# Altium project Daughter_Board_IFRX_L.PrjPcb (part 2 of 2)

## Sheet CPLD.SchDoc: {Наименование}
size 420 x 297 mm; DocumentNumber: НРДЦ.ХХХХХХ.ХХХ ХХ; SheetNumber: {}; SheetTotal: {}; PageSetup: Record=PageOptions|CenterHorizontal=False|CenterVertical=False|PrintScale=0.95|XCorrection=0.00|YCorrection=0.00|PrintKind=1|BorderSize=5000000|LeftOffset=0|BottomOffset=0|Orientation=1|PaperLength=1000|PaperWidth=1000|Scale=100|PaperSource=15|PrintQuality=600|MediaType=1|DitherType=10|PaperKind=A4|PrintScaleMode=1; Rule: PcbType=ProtelPcb
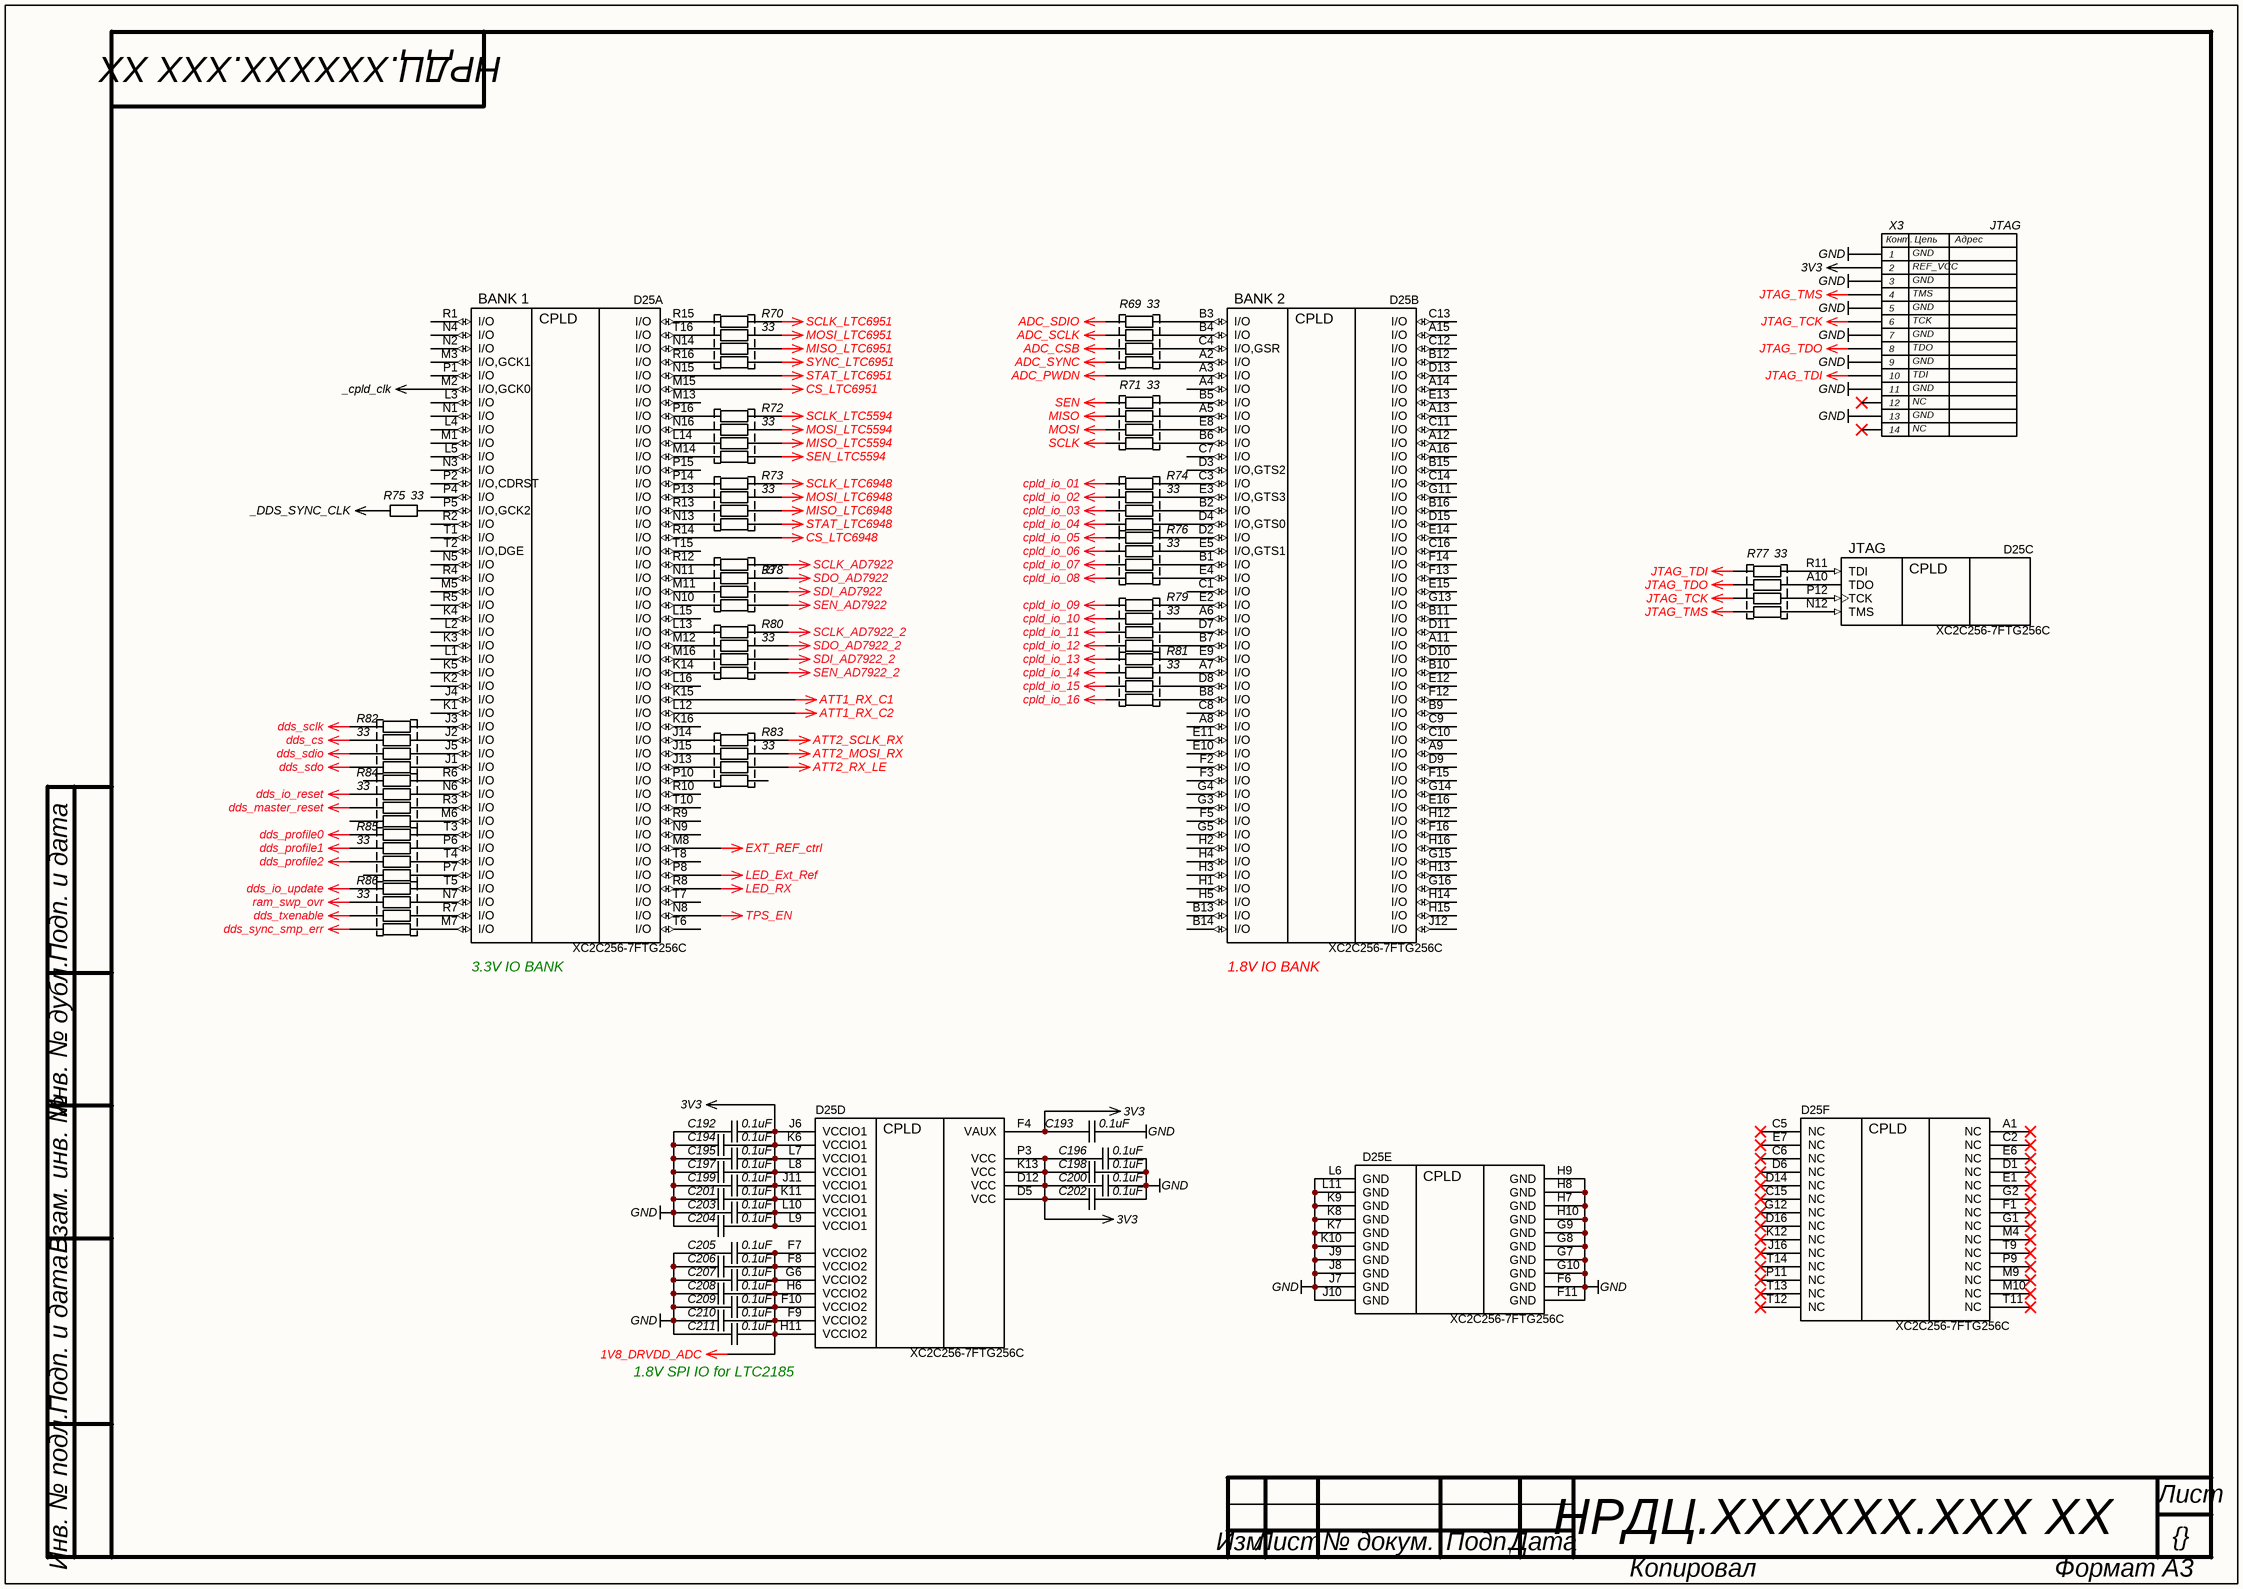
[diagram p4: CPLD.SchDoc]

### Parts
C192  value 0.1uF  [C0402]  (hidden comment: CAP)
C193  value 0.1uF  [C0402]  (hidden comment: CAP)
C194  value 0.1uF  [C0402]  (hidden comment: CAP)
C195  value 0.1uF  [C0402]  (hidden comment: CAP)
C196  value 0.1uF  [C0402]  (hidden comment: CAP)
C197  value 0.1uF  [C0402]  (hidden comment: CAP)
C198  value 0.1uF  [C0402]  (hidden comment: CAP)
C199  value 0.1uF  [C0402]  (hidden comment: CAP)
C200  value 0.1uF  [C0402]  (hidden comment: CAP)
C201  value 0.1uF  [C0402]  (hidden comment: CAP)
C202  value 0.1uF  [C0402]  (hidden comment: CAP)
C203  value 0.1uF  [C0402]  (hidden comment: CAP)
C204  value 0.1uF  [C0402]  (hidden comment: CAP)
C205  value 0.1uF  [C0402]  (hidden comment: CAP)
C206  value 0.1uF  [C0402]  (hidden comment: CAP)
C207  value 0.1uF  [C0402]  (hidden comment: CAP)
C208  value 0.1uF  [C0402]  (hidden comment: CAP)
C209  value 0.1uF  [C0402]  (hidden comment: CAP)
C210  value 0.1uF  [C0402]  (hidden comment: CAP)
C211  value 0.1uF  [C0402]  (hidden comment: CAP)
D25  XC2C256-7FTG256C  [FTG256]  (parts A,B,C,D,E,F of 6)
R69  value 33  [EXN8V]  (hidden comment: RES 4x0402)
R70  value 33  [EXN8V]  (hidden comment: RES 4x0402)
R71  value 33  [EXN8V]  (hidden comment: RES 4x0402)
R72  value 33  [EXN8V]  (hidden comment: RES 4x0402)
R73  value 33  [EXN8V]  (hidden comment: RES 4x0402)
R74  value 33  [EXN8V]  (hidden comment: RES 4x0402)
R75  value 33  [R0402]  (hidden comment: RES)
R76  value 33  [EXN8V]  (hidden comment: RES 4x0402)
R77  value 33  [EXN8V]  (hidden comment: RES 4x0402)
R78  value 33  [EXN8V]  (hidden comment: RES 4x0402)
R79  value 33  [EXN8V]  (hidden comment: RES 4x0402)
R80  value 33  [EXN8V]  (hidden comment: RES 4x0402)
R81  value 33  [EXN8V]  (hidden comment: RES 4x0402)
R82  value 33  [EXN8V]  (hidden comment: RES 4x0402)
R83  value 33  [EXN8V]  (hidden comment: RES 4x0402)
R84  value 33  [EXN8V]  (hidden comment: RES 4x0402)
R85  value 33  [EXN8V]  (hidden comment: RES 4x0402)
R86  value 33  [EXN8V]  (hidden comment: RES 4x0402)
X3  JTAG  [JTAG Mail 2mm]

### Nets
1V8_DRVDD_ADC: C205.2 C206.2 C207.2 C208.2 C209.2 C210.2 C211.2 D25.F7(VCCIO2) D25.F8(VCCIO2) D25.F9(VCCIO2) D25.F10(VCCIO2) D25.G6(VCCIO2) D25.H6(VCCIO2) D25.H11(VCCIO2)
3V3: C192.2 C193.1 C194.2 C195.2 C196.1 C197.2 C198.1 C199.2 C200.1 C201.2 C202.1 C203.2 C204.2 D25.D5(VCC) D25.D12(VCC) D25.F4(VAUX) D25.J6(VCCIO1) D25.J11(VCCIO1) D25.K6(VCCIO1) D25.K11(VCCIO1) D25.K13(VCC) D25.L7(VCCIO1) D25.L8(VCCIO1) D25.L9(VCCIO1) D25.L10(VCCIO1) D25.P3(VCC) X3.2
_cpld_clk: D25.M2(I/O,GCK0)
_DDS_SYNC_CLK: R75.1
ADC_CSB: R69.7
ADC_PWDN: D25.A3(I/O)
ADC_SCLK: R69.6
ADC_SDIO: R69.5
ADC_SYNC: R69.8
ATT1_RX_C1: D25.K15(I/O)
ATT1_RX_C2: D25.L12(I/O)
ATT2_MOSI_RX: R83.3
ATT2_RX_LE: R83.2
ATT2_SCLK_RX: R83.4
cpld_io_01: R74.5
cpld_io_02: R74.6
cpld_io_03: R74.7
cpld_io_04: R74.8
cpld_io_05: R76.5
cpld_io_06: R76.6
cpld_io_07: R76.7
cpld_io_08: R76.8
cpld_io_09: R79.5
cpld_io_10: R79.6
cpld_io_11: R79.7
cpld_io_12: R79.8
cpld_io_13: R81.5
cpld_io_14: R81.6
cpld_io_15: R81.7
cpld_io_16: R81.8
CS_LTC6948: D25.R14(I/O)
CS_LTC6951: D25.M15(I/O)
dds_cs: R82.6
dds_io_reset: R84.6
dds_io_update: R86.5
dds_master_reset: R84.7
dds_profile0: R85.5
dds_profile1: R85.6
dds_profile2: R85.7
dds_sclk: R82.5
dds_sdio: R82.7
dds_sdo: R82.8
dds_sync_smp_err: R86.8
dds_txenable: R86.7
EXT_REF_ctrl: D25.M8(I/O)
GND: C192.1 C193.2 C194.1 C195.1 C196.2 C197.1 C198.2 C199.1 C200.2 C201.1 C202.2 C203.1 C204.1 C205.1 C206.1 C207.1 C208.1 C209.1 C210.1 C211.1 D25.F6(GND) D25.F11(GND) D25.G7(GND) D25.G8(GND) D25.G9(GND) D25.G10(GND) D25.H7(GND) D25.H8(GND) D25.H9(GND) D25.H10(GND) D25.J7(GND) D25.J8(GND) D25.J9(GND) D25.J10(GND) D25.K7(GND) D25.K8(GND) D25.K9(GND) D25.K10(GND) D25.L6(GND) D25.L11(GND) X3.1 X3.3 X3.5 X3.7 X3.9 X3.11 X3.13
JTAG_TCK: R77.7 X3.6
JTAG_TDI: R77.5 X3.10
JTAG_TDO: R77.6 X3.8
JTAG_TMS: R77.8 X3.4
LED_Ext_Ref: D25.P8(I/O)
LED_RX: D25.R8(I/O)
MISO: R71.6
MISO_LTC5594: R72.2
MISO_LTC6948: R73.2
MISO_LTC6951: R70.2
MOSI: R71.7
MOSI_LTC5594: R72.3
MOSI_LTC6948: R73.3
MOSI_LTC6951: R70.3
ram_swp_ovr: R86.6
SCLK: R71.8
SCLK_AD7922: R78.4
SCLK_AD7922_2: R80.4
SCLK_LTC5594: R72.4
SCLK_LTC6948: R73.4
SCLK_LTC6951: R70.4
SDI_AD7922: R78.2
SDI_AD7922_2: R80.2
SDO_AD7922: R78.3
SDO_AD7922_2: R80.3
SEN: R71.5
SEN_AD7922: R78.1
SEN_AD7922_2: R80.1
SEN_LTC5594: R72.1
STAT_LTC6948: R73.1
STAT_LTC6951: D25.N15(I/O)
SYNC_LTC6951: R70.1
TPS_EN: D25.N8(I/O)
NetD25_A2: D25.A2(I/O) R69.1
NetD25_A5: D25.A5(I/O) R71.3
NetD25_A6: D25.A6(I/O) R79.3
NetD25_A7: D25.A7(I/O) R81.3
NetD25_A10: D25.A10(TDO) R77.3
NetD25_B1: D25.B1(I/O) R76.2
NetD25_B2: D25.B2(I/O) R74.2
NetD25_B3: D25.B3(I/O) R69.4
NetD25_B4: D25.B4(I/O) R69.3
NetD25_B5: D25.B5(I/O) R71.4
NetD25_B6: D25.B6(I/O) R71.1
NetD25_B7: D25.B7(I/O) R79.1
NetD25_B8: D25.B8(I/O) R81.1
NetD25_C3: D25.C3(I/O) R74.4
NetD25_C4: D25.C4(I/O,GSR) R69.2
NetD25_D2: D25.D2(I/O) R76.4
NetD25_D4: D25.D4(I/O,GTS0) R74.1
NetD25_D7: D25.D7(I/O) R79.2
NetD25_D8: D25.D8(I/O) R81.2
NetD25_E2: D25.E2(I/O) R79.4
NetD25_E3: D25.E3(I/O,GTS3) R74.3
NetD25_E4: D25.E4(I/O) R76.1
NetD25_E5: D25.E5(I/O,GTS1) R76.3
NetD25_E8: D25.E8(I/O) R71.2
NetD25_E9: D25.E9(I/O) R81.4
NetD25_J1: D25.J1(I/O) R82.1
NetD25_J2: D25.J2(I/O) R82.3
NetD25_J3: D25.J3(I/O) R82.4
NetD25_J5: D25.J5(I/O) R82.2
NetD25_J13: D25.J13(I/O) R83.7
NetD25_J14: D25.J14(I/O) R83.5
NetD25_J15: D25.J15(I/O) R83.6
NetD25_K14: D25.K14(I/O) R80.8
NetD25_L13: D25.L13(I/O) R80.5
NetD25_L14: D25.L14(I/O) R72.7
NetD25_M6: D25.M6(I/O) R84.1
NetD25_M7: D25.M7(I/O) R86.1
NetD25_M11: D25.M11(I/O) R78.7
NetD25_M12: D25.M12(I/O) R80.6
NetD25_M14: D25.M14(I/O) R72.8
NetD25_M16: D25.M16(I/O) R80.7
NetD25_N6: D25.N6(I/O) R84.3
NetD25_N7: D25.N7(I/O) R86.3
NetD25_N10: D25.N10(I/O) R78.8
NetD25_N11: D25.N11(I/O) R78.6
NetD25_N12: D25.N12(TMS) R77.1
NetD25_N13: D25.N13(I/O) R73.8
NetD25_N14: D25.N14(I/O) R70.7
NetD25_N16: D25.N16(I/O) R72.6
NetD25_P5: D25.P5(I/O,GCK2) R75.2
NetD25_P6: D25.P6(I/O) R85.3
NetD25_P7: D25.P7(I/O) R85.1
NetD25_P10: D25.P10(I/O) R83.8
NetD25_P12: D25.P12(TCK) R77.2
NetD25_P13: D25.P13(I/O) R73.6
NetD25_P14: D25.P14(I/O) R73.5
NetD25_P16: D25.P16(I/O) R72.5
NetD25_R3: D25.R3(I/O) R84.2
NetD25_R6: D25.R6(I/O) R84.4
NetD25_R7: D25.R7(I/O) R86.2
NetD25_R11: D25.R11(TDI) R77.4
NetD25_R12: D25.R12(I/O) R78.5
NetD25_R13: D25.R13(I/O) R73.7
NetD25_R15: D25.R15(I/O) R70.5
NetD25_R16: D25.R16(I/O) R70.8
NetD25_T3: D25.T3(I/O) R85.4
NetD25_T4: D25.T4(I/O) R85.2
NetD25_T5: D25.T5(I/O) R86.4
NetD25_T16: D25.T16(I/O) R70.6

Not connected (* = marked no-connect by the designer): D25 A1(NC)* A4(I/O) A8(I/O) A9(I/O) A11(I/O) A12(I/O) A13(I/O) A14(I/O) A15(I/O) A16(I/O) B9(I/O) B10(I/O) B11(I/O) B12(I/O) B13(I/O) B14(I/O) B15(I/O) B16(I/O) C1(I/O) C2(NC)* C5(NC)* C6(NC)* C7(I/O) C8(I/O) C9(I/O) C10(I/O) C11(I/O) C12(I/O) C13(I/O) C14(I/O) C15(NC)* C16(I/O) D1(NC)* D3(I/O,GTS2) D6(NC)* D9(I/O) D10(I/O) D11(I/O) D13(I/O) D14(NC)* D15(I/O) D16(NC)* E1(NC)* E6(NC)* E7(NC)* E10(I/O) E11(I/O) E12(I/O) E13(I/O) E14(I/O) E15(I/O) E16(I/O) F1(NC)* F2(I/O) F3(I/O) F5(I/O) F12(I/O) F13(I/O) F14(I/O) F15(I/O) F16(I/O) G1(NC)* G2(NC)* G3(I/O) G4(I/O) G5(I/O) G11(I/O) G12(NC)* G13(I/O) G14(I/O) G15(I/O) G16(I/O) H1(I/O) H2(I/O) H3(I/O) H4(I/O) H5(I/O) H12(I/O) H13(I/O) H14(I/O) H15(I/O) H16(I/O) J4(I/O) J12(I/O) J16(NC)* K1(I/O) K2(I/O) K3(I/O) K4(I/O) K5(I/O) K12(NC)* K16(I/O) L1(I/O) L2(I/O) L3(I/O) L4(I/O) L5(I/O) L15(I/O) L16(I/O) M1(I/O) M3(I/O,GCK1) M4(NC)* M5(I/O) M9(NC)* M10(NC)* M13(I/O) N1(I/O) N2(I/O) N3(I/O) N4(I/O) N5(I/O) N9(I/O) P1(I/O) P2(I/O,CDRST) P4(I/O) P9(NC)* P11(NC)* P15(I/O) R1(I/O) R2(I/O) R4(I/O) R5(I/O) R9(I/O) R10(I/O) T1(I/O) T2(I/O,DGE) T6(I/O) T7(I/O) T8(I/O) T9(NC)* T10(I/O) T11(NC)* T12(NC)* T13(NC)* T14(NC)* T15(I/O); R83 1; R84 5 8; R85 8; X3 12* 14*

### Notes on the sheet
- (near X3) GND
- (near X3) REF_VCC
- (near X3) TMS
- (near X3) TCK
- (near X3) TDO
- (near X3) TDI
- (near X3) NC
- (near D25) 3.3V IO BANK
- (near D25) 1.8V IO BANK
- 1.8V SPI IO for LTC2185
- Подп. и дата
- Инв. № дубл.
- Взам. инв. №
- Инв. № подл.
- Лист
- Изм.
- № докум.
- Подп.
- Дата
- Копировал
- Формат А3
- (in symbol HDR Debug_14-pin) Конт.; Цепь; Адрес
- (in symbol XC2C256-7FTG256C, part A) BANK 1
- (in symbol XC2C256-7FTG256C, part B) BANK 2
- (in symbol XC2C256-7FTG256C, part C) JTAG

### Library data of the parts
C192-C211 = CAP: SMD Capacitor; Manufacturer: Murata; Material: X7R; Tolerance: 10%; Voltage: 16V; Type: Ceramic Capacitor; P/N: GRM155R71C104KA88J
D25 = XC2C256-7FTG256C: CoolRunner-II 1.8V, 256 Macrocell CPLD, 184 User I/Os, 256-Ball FTBGA, Commercial Grade, Pb-Free; Code_JEDEC: MS-034-AAF-1*; PackageVersion: ver1.3, Oct-2007; PackageReference: FTG256; PackageDescription: 256-Ball Fine Pitch Thin Ball Grid Array 1.00 mm Pitch (FTG256) - Pb-Free; DatasheetVersion: ver3.2, Mar-2007; PartNumber: XC2C256-7FTG256C; P/N: XC2C256-7FTG256C; Name: XC2C256-7FTG256C; Type: CPLD
R69-R74 R76-R86 = RES 4x0402: Chip Resistor Array; Manufacturer: Panasonic; Name: EXBN8V; Number of Resistors: 4; Tolerance: 5%; P/N: ERJ-2GEJ330X; Type: 0402 Array Concave Terminal; Number of Terminals: 8; Series: EXB
R75 = RES: SMD Resistor; Name: Chip SMD Resistor; Power: 0.062 Wt; Tolerance: 5%; P/N: ERJ-2GEJ330X; Temperature Range: -55…155°C
X3 = HDR Debug_14-pin: 2.00mm Pitch, Milli-Grid PCB Header, Dual Row, Vertical, Through Hole, Shrouded, 14 / Circuits; Manufacturer: Molex; Name: Milli-Grid Connector System; P/N: 878311421; Type: 2.00mm Pitch, Milli-Grid PCB Header, Dual Row, Vertical, Through Hole, Shrouded, 14; Series: 87831

## Sheet Power.SchDoc: {Наименование}
size 420 x 297 mm; ApprovedBy: {Утвердил}; CheckedBy: {Проверил}; DrawnBy: {Разраб.}; DocumentNumber: НРДЦ.ХХХХХХ.ХХХ 00; SheetNumber: {}; SheetTotal: {}; Scale: {Мш.}; PageSetup: Record=PageOptions|CenterHorizontal=False|CenterVertical=False|PrintScale=0.95|XCorrection=0.00|YCorrection=0.00|PrintKind=1|BorderSize=5000000|LeftOffset=0|BottomOffset=0|Orientation=1|PaperLength=1000|PaperWidth=1000|Scale=100|PaperSource=15|PrintQuality=600|MediaType=1|DitherType=10|PaperKind=A4|PrintScaleMode=1; ProcessInspection: {Т.контр.}; Mass: {М.}; NormInspection: {Н.контр.}; Letter1Column: {}; Letter2Column: {}; Letter3Column: {}; DocumentType: {Документ}; Rule: PcbType=ProtelPcb
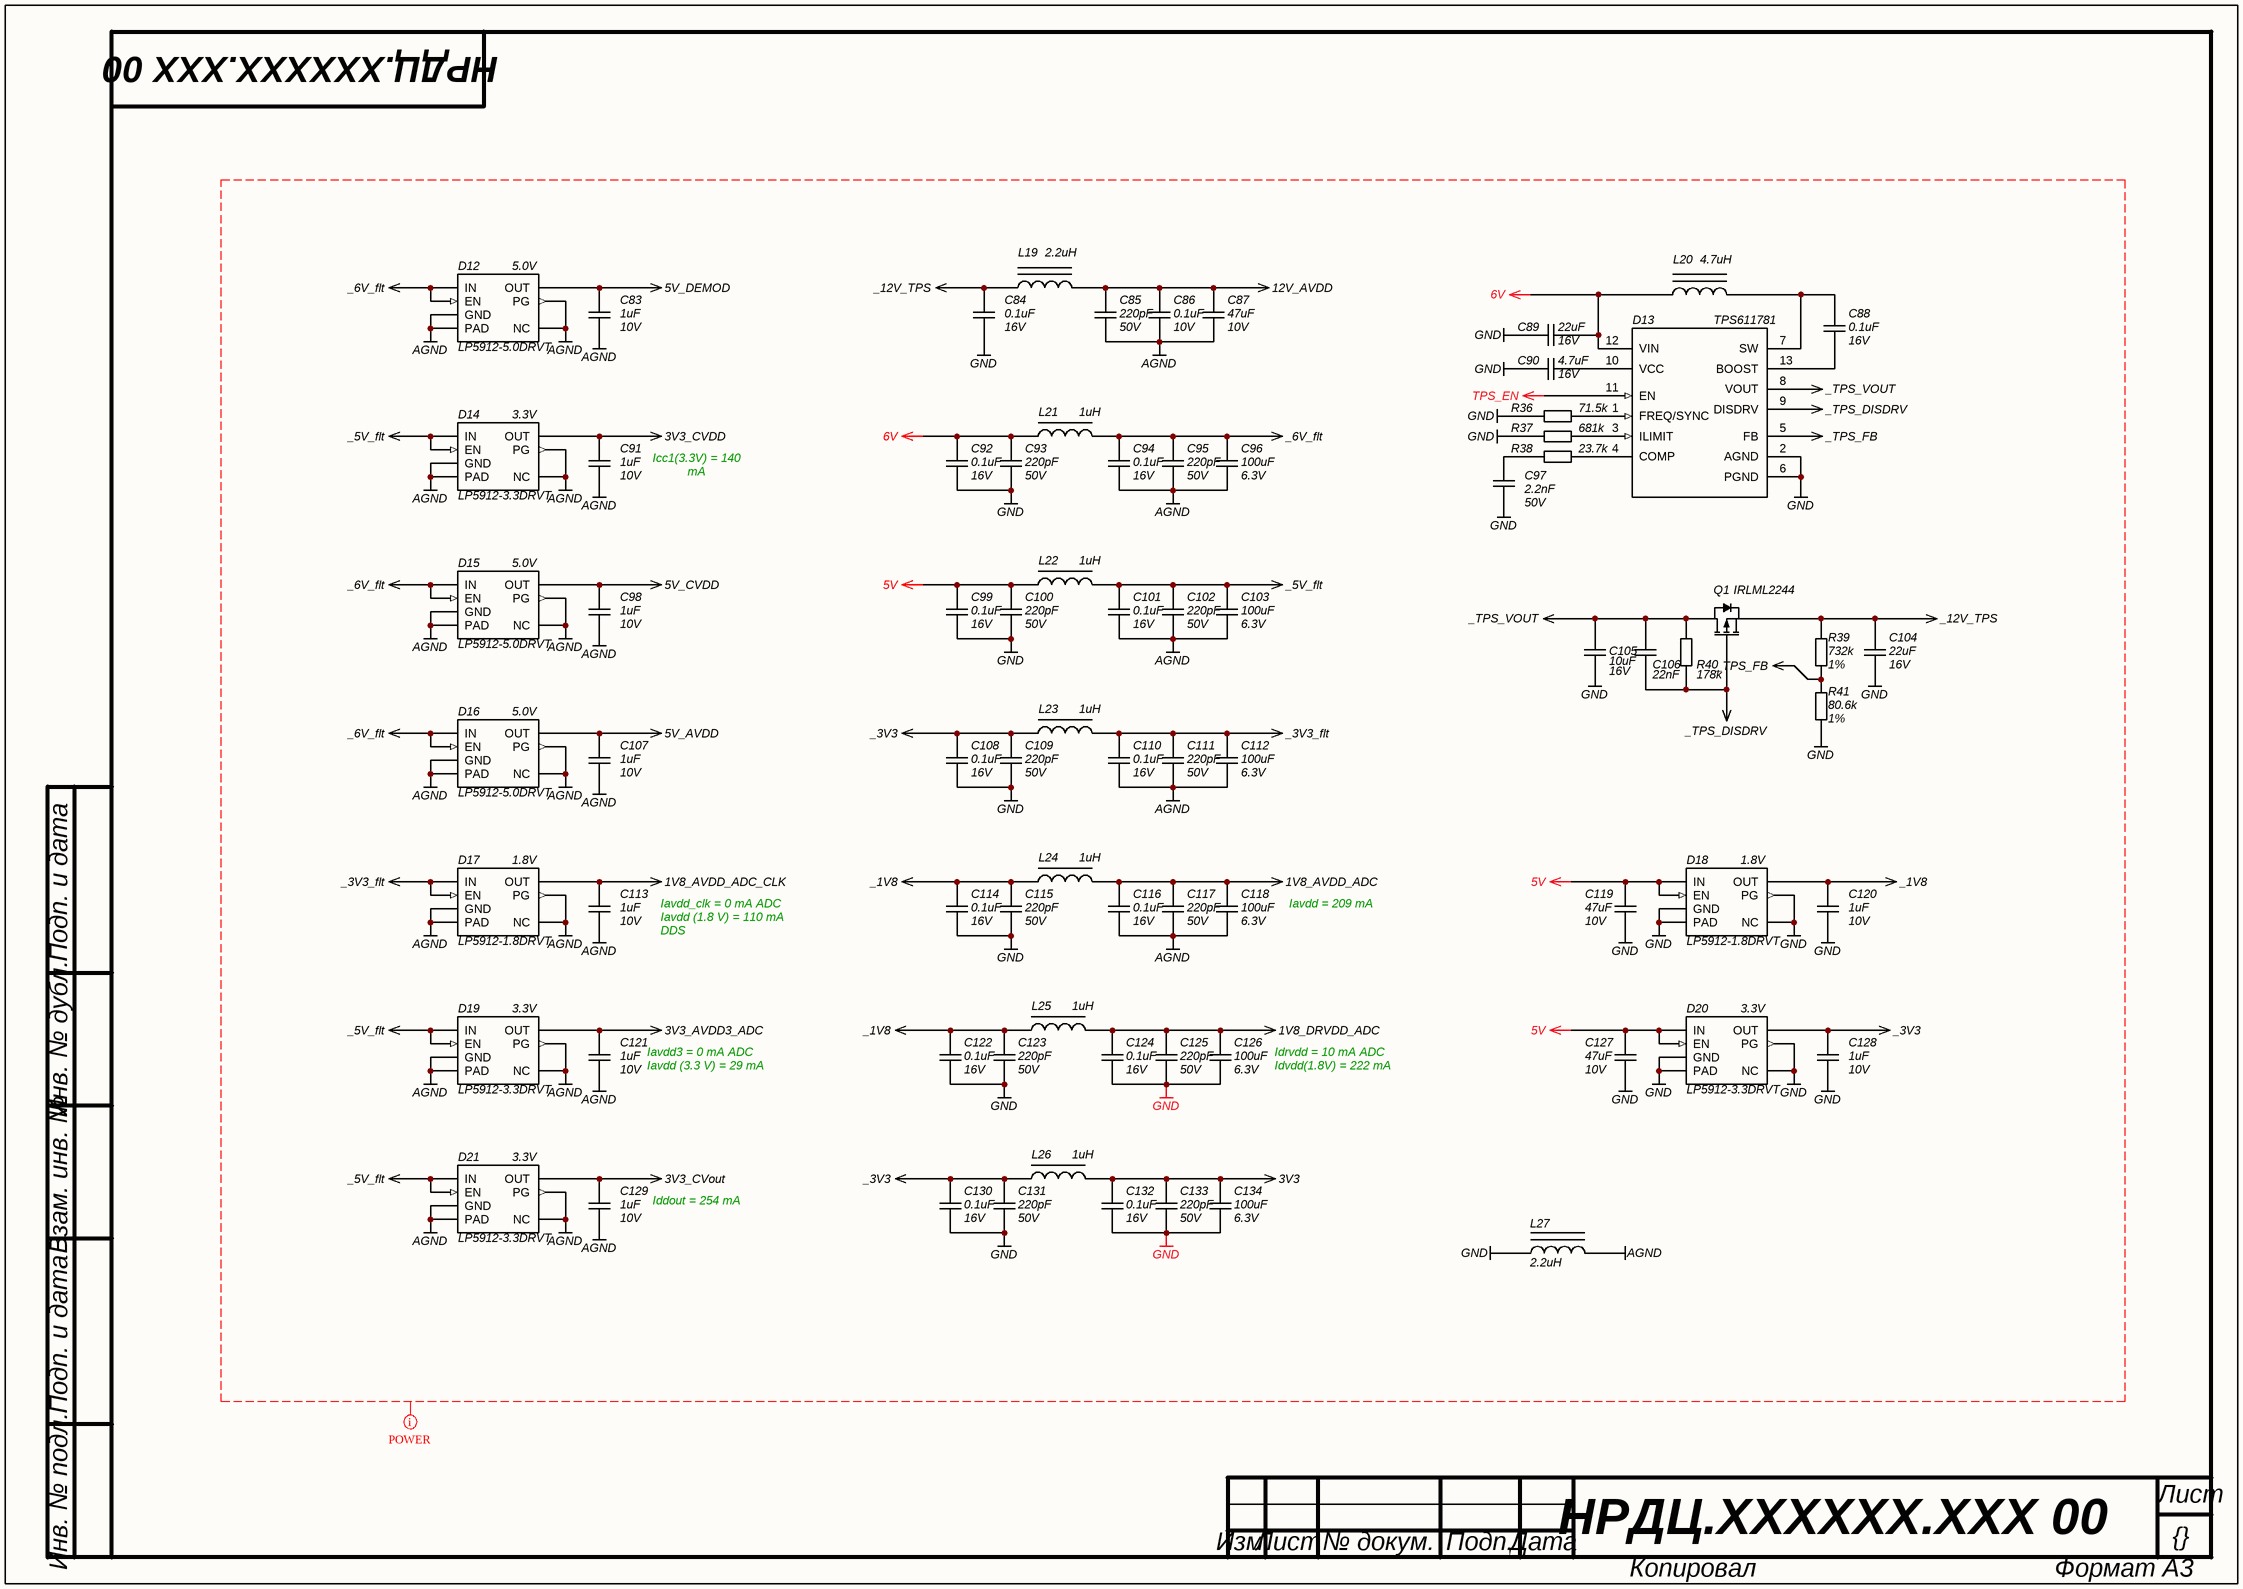
[diagram p5: Power.SchDoc]

### Parts
C83  value 1uF  Voltage: 10V  [C0805]  (hidden comment: CAP)
C84  value 0.1uF  Voltage: 16V  [C0402]  (hidden comment: CAP)
C85  value 220pF  Voltage: 50V  [C0603]  (hidden comment: CAP)
C86  value 0.1uF  Voltage: 10V  [C0402]  (hidden comment: CAP)
C87  value 47uF  Voltage: 10V  [C1210]  (hidden comment: CAP uF)
C88  value 0.1uF  Voltage: 16V  [C0402]  (hidden comment: CAP)
C89  value 22uF  Voltage: 16V  [C0805]  (hidden comment: CAP uF)
C90  value 4.7uF  Voltage: 16V  [C0603]  (hidden comment: CAP)
C91  value 1uF  Voltage: 10V  [C0805]  (hidden comment: CAP)
C92  value 0.1uF  Voltage: 16V  [C0603]  (hidden comment: CAP)
C93  value 220pF  Voltage: 50V  [C0603]  (hidden comment: CAP)
C94  value 0.1uF  Voltage: 16V  [C0603]  (hidden comment: CAP)
C95  value 220pF  Voltage: 50V  [C0603]  (hidden comment: CAP)
C96  value 100uF  Voltage: 6.3V  [C1210]  (hidden comment: CAP uF)
C97  value 2.2nF  Voltage: 50V  [C0603]  (hidden comment: CAP)
C98  value 1uF  Voltage: 10V  [C0805]  (hidden comment: CAP)
C99  value 0.1uF  Voltage: 16V  [C0603]  (hidden comment: CAP)
C100  value 220pF  Voltage: 50V  [C0603]  (hidden comment: CAP)
C101  value 0.1uF  Voltage: 16V  [C0603]  (hidden comment: CAP)
C102  value 220pF  Voltage: 50V  [C0603]  (hidden comment: CAP)
C103  value 100uF  Voltage: 6.3V  [C1210]  (hidden comment: CAP uF)
C104  value 22uF  Voltage: 16V  [C0805]  (hidden comment: CAP uF)
C105  value 10uF  Voltage: 16V  [C0805]  (hidden comment: CAP uF)
C106  value 22nF  [C0402]  (hidden comment: CAP)
C107  value 1uF  Voltage: 10V  [C0805]  (hidden comment: CAP)
C108  value 0.1uF  Voltage: 16V  [C0603]  (hidden comment: CAP)
C109  value 220pF  Voltage: 50V  [C0603]  (hidden comment: CAP)
C110  value 0.1uF  Voltage: 16V  [C0603]  (hidden comment: CAP)
C111  value 220pF  Voltage: 50V  [C0603]  (hidden comment: CAP)
C112  value 100uF  Voltage: 6.3V  [C1210]  (hidden comment: CAP uF)
C113  value 1uF  Voltage: 10V  [C0805]  (hidden comment: CAP)
C114  value 0.1uF  Voltage: 16V  [C0603]  (hidden comment: CAP)
C115  value 220pF  Voltage: 50V  [C0603]  (hidden comment: CAP)
C116  value 0.1uF  Voltage: 16V  [C0603]  (hidden comment: CAP)
C117  value 220pF  Voltage: 50V  [C0603]  (hidden comment: CAP)
C118  value 100uF  Voltage: 6.3V  [C1210]  (hidden comment: CAP uF)
C119  value 47uF  Voltage: 10V  [C1210]  (hidden comment: CAP uF)
C120  value 1uF  Voltage: 10V  [C0805]  (hidden comment: CAP)
C121  value 1uF  Voltage: 10V  [C0805]  (hidden comment: CAP)
C122  value 0.1uF  Voltage: 16V  [C0603]  (hidden comment: CAP)
C123  value 220pF  Voltage: 50V  [C0603]  (hidden comment: CAP)
C124  value 0.1uF  Voltage: 16V  [C0603]  (hidden comment: CAP)
C125  value 220pF  Voltage: 50V  [C0603]  (hidden comment: CAP)
C126  value 100uF  Voltage: 6.3V  [C1210]  (hidden comment: CAP uF)
C127  value 47uF  Voltage: 10V  [C1210]  (hidden comment: CAP uF)
C128  value 1uF  Voltage: 10V  [C0805]  (hidden comment: CAP)
C129  value 1uF  Voltage: 10V  [C0805]  (hidden comment: CAP)
C130  value 0.1uF  Voltage: 16V  [C0603]  (hidden comment: CAP)
C131  value 220pF  Voltage: 50V  [C0603]  (hidden comment: CAP)
C132  value 0.1uF  Voltage: 16V  [C0603]  (hidden comment: CAP)
C133  value 220pF  Voltage: 50V  [C0603]  (hidden comment: CAP)
C134  value 100uF  Voltage: 6.3V  [C1210]  (hidden comment: CAP uF)
D12  Name: LP5912-5.0DRVT  Voltage: 5.0V  [WSON-6]  (hidden comment: LP5912)
D13  TPS611781  [TPS611781x]
D14  Name: LP5912-3.3DRVT  Voltage: 3.3V  [WSON-6]  (hidden comment: LP5912)
D15  Name: LP5912-5.0DRVT  Voltage: 5.0V  [WSON-6]  (hidden comment: LP5912)
D16  Name: LP5912-5.0DRVT  Voltage: 5.0V  [WSON-6]  (hidden comment: LP5912)
D17  Name: LP5912-1.8DRVT  Voltage: 1.8V  [WSON-6]  (hidden comment: LP5912)
D18  Name: LP5912-1.8DRVT  Voltage: 1.8V  [WSON-6]  (hidden comment: LP5912)
D19  Name: LP5912-3.3DRVT  Voltage: 3.3V  [WSON-6]  (hidden comment: LP5912)
D20  Name: LP5912-3.3DRVT  Voltage: 3.3V  [WSON-6]  (hidden comment: LP5912)
D21  Name: LP5912-3.3DRVT  Voltage: 3.3V  [WSON-6]  (hidden comment: LP5912)
L19  value 2.2uH  [XAL4020]  (hidden comment: Inductor PWR)
L20  value 4.7uH  [XAL4030]  (hidden comment: Inductor PWR)
L21  value 1uH  [L1210_Murata LQH]  (hidden comment: Inductor LF)
L22  value 1uH  [L1210_Murata LQH]  (hidden comment: Inductor LF)
L23  value 1uH  [L1210_Murata LQH]  (hidden comment: Inductor LF)
L24  value 1uH  [L1210_Murata LQH]  (hidden comment: Inductor LF)
L25  value 1uH  [L1210_Murata LQH]  (hidden comment: Inductor LF)
L26  value 1uH  [L1210_Murata LQH]  (hidden comment: Inductor LF)
L27  value 2.2uH  [XAL4020]  (hidden comment: Inductor PWR)
Q1  IRLML2244  [SOT-23]
R36  value 71.5k  [R0402]  (hidden comment: RES)
R37  value 681k  [R0402]  (hidden comment: RES)
R38  value 23.7k  [R0603]  (hidden comment: RES)
R39  value 732k  Tolerance: 1%  [R0402]  (hidden comment: RES)
R40  value 178k  [R0402]  (hidden comment: RES)
R41  value 80.6k  Tolerance: 1%  [R0402]  (hidden comment: RES)

### Nets
1V8_AVDD_ADC: C116.2 C117.2 C118.2 L24.2
1V8_AVDD_ADC_CLK: C113.1 D17.1(OUT)
1V8_DRVDD_ADC: C124.2 C125.2 C126.2 L25.2
3V3: C132.2 C133.2 C134.2 L26.2
3V3_AVDD3_ADC: C121.1 D19.1(OUT)
3V3_CVDD: C91.1 D14.1(OUT)
3V3_CVout: C129.1 D21.1(OUT)
5V: C99.2 C100.2 C119.2 C127.2 D18.4(EN) D18.6(IN) D20.4(EN) D20.6(IN) L22.1
5V_AVDD: C107.1 D16.1(OUT)
5V_CVDD: C98.1 D15.1(OUT)
5V_DEMOD: C83.1 D12.1(OUT)
6V: C89.1 C92.2 C93.2 D13.12(VIN) L20.1 L21.1
12V_AVDD: C85.2 C86.2 C87.2 L19.2
_1V8: C114.2 C115.2 C120.1 C122.2 C123.2 D18.1(OUT) L24.1 L25.1
_3V3: C108.2 C109.2 C128.1 C130.2 C131.2 D20.1(OUT) L23.1 L26.1
_3V3_flt: C110.2 C111.2 C112.2 D17.4(EN) D17.6(IN) L23.2
_5V_flt: C101.2 C102.2 C103.2 D14.4(EN) D14.6(IN) D19.4(EN) D19.6(IN) D21.4(EN) D21.6(IN) L22.2
_6V_flt: C94.2 C95.2 C96.2 D12.4(EN) D12.6(IN) D15.4(EN) D15.6(IN) D16.4(EN) D16.6(IN) L21.2
_12V_TPS: C84.2 C104.2 L19.1 Q1.2(S) R39.2
_TPS_DISDRV: C106.2 D13.9(DISDRV) Q1.1(G) R40.1
_TPS_FB: D13.5(FB) R39.1 R41.2
_TPS_VOUT: C105.2 C106.1 D13.8(VOUT) Q1.3(D) R40.2
AGND: C83.2 C85.1 C86.1 C87.1 C91.2 C94.1 C95.1 C96.1 C98.2 C101.1 C102.1 C103.1 C107.2 C110.1 C111.1 C112.1 C113.2 C116.1 C117.1 C118.1 C121.2 C129.2 D12.0(PAD) D12.2(NC) D12.3(PG) D12.5(GND) D14.0(PAD) D14.2(NC) D14.3(PG) D14.5(GND) D15.0(PAD) D15.2(NC) D15.3(PG) D15.5(GND) D16.0(PAD) D16.2(NC) D16.3(PG) D16.5(GND) D17.0(PAD) D17.2(NC) D17.3(PG) D17.5(GND) D19.0(PAD) D19.2(NC) D19.3(PG) D19.5(GND) D21.0(PAD) D21.2(NC) D21.3(PG) D21.5(GND) L27.2
GND: C84.1 C89.2 C90.2 C92.1 C93.1 C97.1 C99.1 C100.1 C104.1 C105.1 C108.1 C109.1 C114.1 C115.1 C119.1 C120.2 C122.1 C123.1 C124.1 C125.1 C126.1 C127.1 C128.2 C130.1 C131.1 C132.1 C133.1 C134.1 D13.2(AGND) D13.6(PGND) D18.0(PAD) D18.2(NC) D18.3(PG) D18.5(GND) D20.0(PAD) D20.2(NC) D20.3(PG) D20.5(GND) L27.1 R36.1 R37.1 R41.1
TPS_EN: D13.11(EN)
NetC88_1: C88.1 D13.13(BOOST)
NetC88_2: C88.2 D13.7(SW) L20.2
NetC90_1: C90.1 D13.10(VCC)
NetC97_2: C97.2 R38.1
NetD13_1: D13.1(FREQ/SYNC) R36.2
NetD13_3: D13.3(ILIMIT) R37.2
NetD13_4: D13.4(COMP) R38.2

### Layout directives
net class POWER: 1V8_AVDD_ADC, 1V8_AVDD_ADC_CLK, 1V8_DRVDD_ADC, 3V3, 3V3_AVDD3_ADC, 3V3_CVDD, 3V3_CVout, 5V, 5V_AVDD, 5V_CVDD, 5V_DEMOD, 6V, 12V_AVDD, _1V8, _3V3, _3V3_flt, _5V_flt, _6V_flt, _12V_TPS, _TPS_DISDRV, _TPS_FB, _TPS_VOUT, AGND, GND, TPS_EN

### Notes on the sheet
- (near C91) Icc1(3.3V) = 140 mA
  Icc2(3.3V) = 130 mA
- Iavdd_clk = 0 mA ADC
  Iavdd (1.8 V) = 110 mA DDS
- Iavdd = 209 mA ADC
- (near C121) Iavdd3 = 0 mA ADC
  Iavdd (3.3 V) = 29 mA DDS
- Idrvdd = 10 mA ADC
  Idvdd(1.8V) = 222 mA DDS
- (near C129) Iddout = 254 mA
- Подп. и дата
- Инв. № дубл.
- Взам. инв. №
- Инв. № подл.
- Лист
- Изм.
- № докум.
- Подп.
- Дата
- Копировал
- Формат А3

### Library data of the parts
C83 C91 C98 C107 C113 C120 C121 C128 C129 = CAP: SMD Capacitor; Manufacturer: Murata; Material: X7R; Tolerance: 10%; Type: Ceramic Capacitor; P/N: GRM21BR71A105KA01K
C84 C88 = CAP: SMD Capacitor; Manufacturer: Murata; Material: X5R; Tolerance: ±10%; Type: Ceramic Capacitor; P/N: GRM155R61C104KA88D
C85 C93 C95 C100 C102 C109 C111 C115 C117 C123 C125 C131 C133 = CAP: SMD Capacitor; Manufacturer: Murata; Material: X7R; Tolerance: 10%; Type: Ceramic Capacitor; P/N: GRM188R71H221KA01D
C86 = CAP: SMD Capacitor; Manufacturer: Murata; Material: X7R; Tolerance: 10%; Type: Ceramic Capacitor; P/N: GRM155R71A104KA01J
C87 C119 C127 = CAP uF: SMD Capacitor; Manufacturer: Murata; Material: X7R; Tolerance: 10%; Type: Ceramic Capacitor; P/N: GRM32ER71A476KE15L
C89 C104 = CAP uF: SMD Capacitor; Manufacturer: Murata; Material: X5R; Tolerance: ±20%; Type: Ceramic Capacitor; P/N: GRM21BR61C226ME44L
C90 = CAP: SMD Capacitor; Manufacturer: Murata; Material: X5R; Tolerance: 10%; Type: Ceramic Capacitor; P/N: GRM188R61C475KAAJD
C92 C94 C99 C101 C108 C110 C114 C116 C122 C124 C130 C132 = CAP: SMD Capacitor; Manufacturer: Murata; Material: X7R; Tolerance: 10%; Type: Ceramic Capacitor; P/N: GRM188R71C104KA01D
C96 C103 C112 C118 C126 C134 = CAP uF: SMD Capacitor; Manufacturer: Murata; Material: X5R; Tolerance: 20%; Type: Ceramic Capacitor; P/N: GRM32ER60J107ME20L
C97 = CAP: SMD Capacitor; Manufacturer: Murata; Material: NP0; Tolerance: ±5%; Type: Ceramic Capacitor; P/N: GRM1885C1H222JA01D
C105 = CAP uF: SMD Capacitor; Manufacturer: Murata; Material: X5R; Tolerance: ±10%; Type: Ceramic Capacitor; P/N: GRM21BR61C106KE15K
C106 = CAP: SMD Capacitor; Manufacturer: Murata; Material: X7R; Tolerance: 10%; Voltage: 50V; Type: Ceramic Capacitor; P/N: GCM155R71H223KA55D
D12 D14-D21 = LP5912: LP5912 500-mA Low-Noise, Low-IQ LDO; Manufacturer: Texas Instruments; Type: Low-Noise LDO; Current: 500mA; Package: WSON; Temperature Range: –40°C to 125°C
  D12 D15 D16: P/N: LP5912-5.0DRVT; Supplier 1: Arrow Electronics; Supplier Part Number 1: LP5912-5.0DRVT
  D14 D19-D21: P/N: LP5912-3.3DRVT; Supplier 1: Digi-Key; Supplier Part Number 1: 296-44153-2-ND
  D17 D18: P/N: LP5912-1.8DRVT; Supplier 1: Digi-Key; Supplier Part Number 1: 296-44156-6-ND
D13 = TPS611781: 10-A Fully-Integrated Synchronous Boost with Load Disconnect Control; Manufacturer: Texas Instruments; Voltage: 4.5 V to 20 V; P/N: TPS611781RNW; Current: 10 A; Name: TPS611781; Package: 13-VQFN-HR (3.5x3.0); Temperature Range: –40°C to 125°C; Type: Synchronous Boost; Supplier 1: Digi-Key; Supplier Part Number 1: 296-46568-1-ND
L19 L27 = Inductor PWR: Magnetic-Core Inductor; Manufacturer: Coilcraft; Name: XEL4020-222MEB; Current: 5.9A; Tolerance: ±30%; Temperature Range: -40ºC to 125ºC
L20 = Inductor PWR: Magnetic-Core Inductor; Manufacturer: Coilcraft; Name: XEL4030-472MEB; Current: 5A; Tolerance: ±30%; Temperature Range: -40ºC to 125ºC
L21-L26 = Inductor LF: Inductor Power Lines; Manufacturer: Murata; Name: LQH32PN1R0NNC; Current: 2500mA; Tolerance: 5%; Frequency: 100MHz; Temperature Range: -25ºC to 85ºC; Series: LQH; P/N: LQH32PN1R0NNC
Q1 = IRLML2244: P-Channel MOSFET; Current: 4.3A; Channel Resistance: 54 mΩ; Power Dissipation: 1.3W; Voltage: -20V; Name: IRLML2244; Package: SOT-23; Type: P-Channel Mosfet
R36 = RES: SMD Resistor; Manufacturer: Panasonic Electronic Components; Name: Chip SMD Resistor; Power: 0.063 Wt; Tolerance: 1%; P/N: ERJ-2RKF7152X; Temperature Range: -55…155°C
R37 = RES: SMD Resistor; Manufacturer: Panasonic Electronic Components; Name: Chip SMD Resistor; Power: 0.063 Wt; Tolerance: 1%; P/N: ERJ-2RKF6813X; Temperature Range: -55…155°C
R38 = RES: SMD Resistor; Manufacturer: Panasonic Electronic Components; Name: Chip SMD Resistor; Power: 0.1 Wt; Tolerance: 1%; P/N: ERJ-3EKF2372V; Temperature Range: -55…155°C
R39 = RES: SMD Resistor; Manufacturer: Panasonic Electronic Components; Name: Chip SMD Resistor; Power: 0.063 Wt; P/N: ERJ-2RKF7323X; Temperature Range: -55…155°C
R40 = RES: SMD Resistor; Manufacturer: Panasonic Electronic Components; Name: Chip SMD Resistor; Power: 0.063 Wt; Tolerance: 1%; P/N: ERJ-2RKF1783X; Temperature Range: -55…155°C
R41 = RES: SMD Resistor; Manufacturer: Panasonic Electronic Components; Name: Chip SMD Resistor; Power: 0.063 Wt; P/N: ERJ-2RKF8062X; Temperature Range: -55…155°C

## Sheet DBoard_Conn.SchDoc: {Наименование}
size 420 x 297 mm; DocumentNumber: НРДЦ.ХХХХХХ.ХХХ ХХ; SheetNumber: {}; SheetTotal: {}; PageSetup: Record=PageOptions|CenterHorizontal=False|CenterVertical=False|PrintScale=0.95|XCorrection=0.00|YCorrection=0.00|PrintKind=1|BorderSize=5000000|LeftOffset=0|BottomOffset=0|Orientation=1|PaperLength=1000|PaperWidth=1000|Scale=100|PaperSource=15|PrintQuality=600|MediaType=1|DitherType=10|PaperKind=A4|PrintScaleMode=1; Rule: PcbType=ProtelPcb
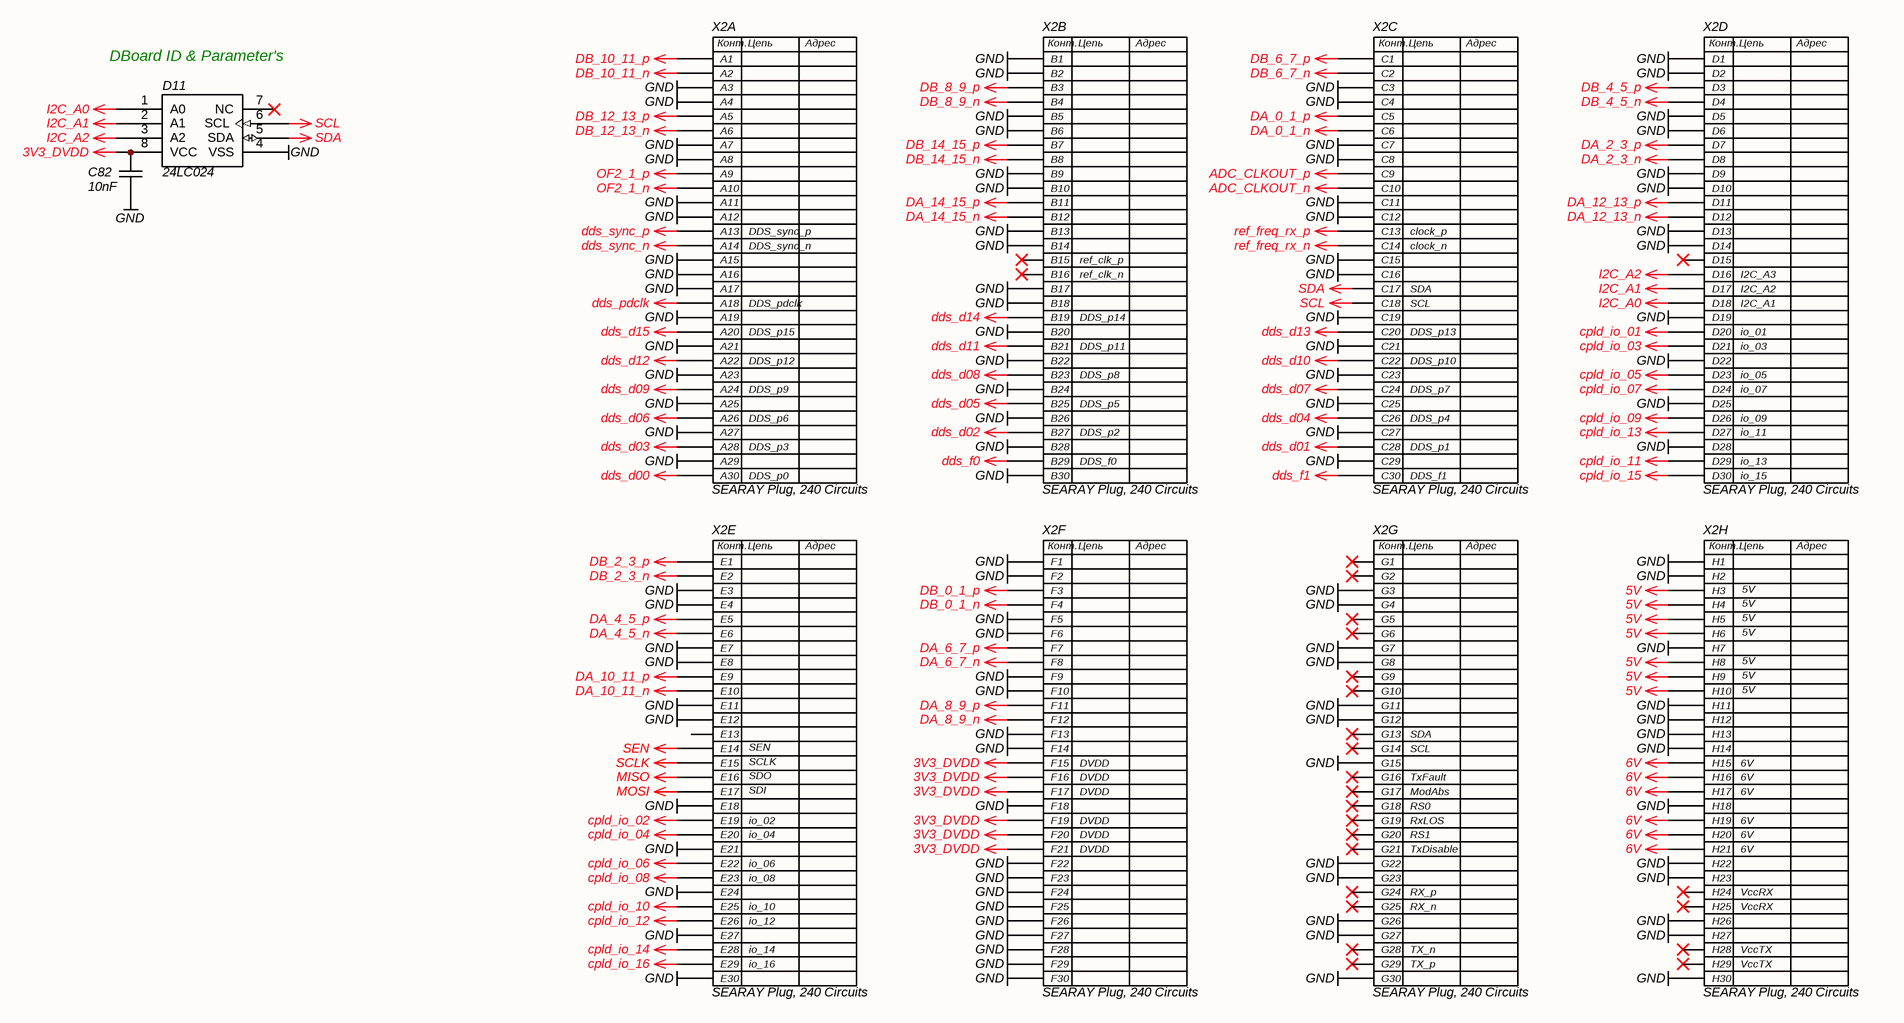
[diagram p6: DBoard_Conn.SchDoc]

### Parts
C82  value 10nF  [C0402]  (hidden comment: CAP)
D11  24LC024  [SOIC_SN8]
X2  SEARAY Plug, 240 Circuits  [Molex_459703185]  (parts A,B,C,D,E,F,G,H of 8)

### Nets
3V3_DVDD: C82.2 D11.8(VCC) X2.F15 X2.F16 X2.F17 X2.F19 X2.F20 X2.F21
5V: X2.H3 X2.H4 X2.H5 X2.H6 X2.H8 X2.H9 X2.H10
6V: X2.H15 X2.H16 X2.H17 X2.H19 X2.H20 X2.H21
ADC_CLKOUT_n: X2.C10
ADC_CLKOUT_p: X2.C9
cpld_io_01: X2.D20
cpld_io_02: X2.E19
cpld_io_03: X2.D21
cpld_io_04: X2.E20
cpld_io_05: X2.D23
cpld_io_06: X2.E22
cpld_io_07: X2.D24
cpld_io_08: X2.E23
cpld_io_09: X2.D26
cpld_io_10: X2.E25
cpld_io_11: X2.D29
cpld_io_12: X2.E26
cpld_io_13: X2.D27
cpld_io_14: X2.E28
cpld_io_15: X2.D30
cpld_io_16: X2.E29
DA_0_1_n: X2.C6
DA_0_1_p: X2.C5
DA_2_3_n: X2.D8
DA_2_3_p: X2.D7
DA_4_5_n: X2.E6
DA_4_5_p: X2.E5
DA_6_7_n: X2.F8
DA_6_7_p: X2.F7
DA_8_9_n: X2.F12
DA_8_9_p: X2.F11
DA_10_11_n: X2.E10
DA_10_11_p: X2.E9
DA_12_13_n: X2.D12
DA_12_13_p: X2.D11
DA_14_15_n: X2.B12
DA_14_15_p: X2.B11
DB_0_1_n: X2.F4
DB_0_1_p: X2.F3
DB_2_3_n: X2.E2
DB_2_3_p: X2.E1
DB_4_5_n: X2.D4
DB_4_5_p: X2.D3
DB_6_7_n: X2.C2
DB_6_7_p: X2.C1
DB_8_9_n: X2.B4
DB_8_9_p: X2.B3
DB_10_11_n: X2.A2
DB_10_11_p: X2.A1
DB_12_13_n: X2.A6
DB_12_13_p: X2.A5
DB_14_15_n: X2.B8
DB_14_15_p: X2.B7
dds_d00: X2.A30
dds_d01: X2.C28
dds_d02: X2.B27
dds_d03: X2.A28
dds_d04: X2.C26
dds_d05: X2.B25
dds_d06: X2.A26
dds_d07: X2.C24
dds_d08: X2.B23
dds_d09: X2.A24
dds_d10: X2.C22
dds_d11: X2.B21
dds_d12: X2.A22
dds_d13: X2.C20
dds_d14: X2.B19
dds_d15: X2.A20
dds_f0: X2.B29
dds_f1: X2.C30
dds_pdclk: X2.A18
dds_sync_n: X2.A14
dds_sync_p: X2.A13
GND: C82.1 D11.4(VSS) X2.A3 X2.A4 X2.A7 X2.A8 X2.A11 X2.A12 X2.A15 X2.A16 X2.A17 X2.A19 X2.A21 X2.A23 X2.A25 X2.A27 X2.A29 X2.B1 X2.B2 X2.B5 X2.B6 X2.B9 X2.B10 X2.B13 X2.B14 X2.B17 X2.B18 X2.B20 X2.B22 X2.B24 X2.B26 X2.B28 X2.B30 X2.C3 X2.C4 X2.C7 X2.C8 X2.C11 X2.C12 X2.C15 X2.C16 X2.C19 X2.C21 X2.C23 X2.C25 X2.C27 X2.C29 X2.D1 X2.D2 X2.D5 X2.D6 X2.D9 X2.D10 X2.D13 X2.D14 X2.D19 X2.D22 X2.D25 X2.D28 X2.E3 X2.E4 X2.E7 X2.E8 X2.E11 X2.E12 X2.E18 X2.E21 X2.E24 X2.E27 X2.E30 X2.F1 X2.F2 X2.F5 X2.F6 X2.F9 X2.F10 X2.F13 X2.F14 X2.F18 X2.F22 X2.F23 X2.F24 X2.F25 X2.F26 X2.F27 X2.F28 X2.F29 X2.F30 X2.G3 X2.G4 X2.G7 X2.G8 X2.G11 X2.G12 X2.G15 X2.G22 X2.G23 X2.G26 X2.G27 X2.G30 X2.H1 X2.H2 X2.H7 X2.H11 X2.H12 X2.H13 X2.H14 X2.H18 X2.H22 X2.H23 X2.H26 X2.H27 X2.H30
I2C_A0: D11.1(A0) X2.D18
I2C_A1: D11.2(A1) X2.D17
I2C_A2: D11.3(A2) X2.D16
MISO: X2.E16
MOSI: X2.E17
OF2_1_n: X2.A10
OF2_1_p: X2.A9
ref_freq_rx_n: X2.C14
ref_freq_rx_p: X2.C13
SCL: D11.6(SCL) X2.C18
SCLK: X2.E15
SDA: D11.5(SDA) X2.C17
SEN: X2.E14

Not connected (* = marked no-connect by the designer): D11 7(NC)*; X2 B15* B16* D15* E13 G1* G2* G5* G6* G9* G10* G13* G14* G16* G17* G18* G19* G20* G21* G24* G25* G28* G29* H24* H25* H28* H29*

### Notes on the sheet
- (near D11) DBoard ID & Parameter's
- (near X2) ref_clk_p
- (near X2) ref_clk_n
- (near X2) clock_n
- (near X2) clock_p
- (near X2) I2C_A3
- (near X2) SCL
- (near X2) SDA
- (near X2) I2C_A2
- (near X2) I2C_A1
- (near X2) io_01
- (near X2) io_03
- (near X2) io_05
- (near X2) io_07
- (near X2) io_09
- (near X2) io_11
- (near X2) io_13
- (near X2) io_15
- (near X2) 5V
- (near X2) SCLK
- (near X2) SDO
- (near X2) SEN
- (near X2) DVDD
- (near X2) 6V
- (near X2) SDI
- (near X2) io_02
- (near X2) io_04
- (near X2) io_06
- (near X2) io_08
- (near X2) io_10
- (near X2) io_12
- (near X2) io_14
- (near X2) io_16
- Labels drawn without touching a wire or pin: DDS_f0, DDS_f1, DDS_p0, DDS_p1, DDS_p2, DDS_p3, DDS_p4, DDS_p5, DDS_p6, DDS_p7, DDS_p8, DDS_p9, DDS_p10, DDS_p11, DDS_p12, DDS_p13, DDS_p14, DDS_p15, DDS_pdclk, DDS_sync_n, DDS_sync_p, ModAbs, RS0, RS1, RX_n, RX_p, RxLOS, SCL, SDA, TX_n, TX_p, TxDisable, TxFault, VccRX, VccTX
- Подп. и дата
- Инв. № дубл.
- Взам. инв. №
- Инв. № подл.
- Лист
- Изм.
- № докум.
- Подп.
- Дата
- Копировал
- Формат А3
- (in symbol Molex_SEARAY™ 45970, part A) Конт.; Цепь; Адрес
- (in symbol Molex_SEARAY™ 45970, part B) Конт.; Цепь; Адрес
- (in symbol Molex_SEARAY™ 45970, part C) Конт.; Цепь; Адрес
- (in symbol Molex_SEARAY™ 45970, part D) Конт.; Цепь; Адрес
- (in symbol Molex_SEARAY™ 45970, part E) Конт.; Цепь; Адрес
- (in symbol Molex_SEARAY™ 45970, part F) Конт.; Цепь; Адрес
- (in symbol Molex_SEARAY™ 45970, part G) Конт.; Цепь; Адрес
- (in symbol Molex_SEARAY™ 45970, part H) Конт.; Цепь; Адрес

### Library data of the parts
C82 = CAP: SMD Capacitor; Manufacturer: Murata; Material: X7R; Tolerance: 10%; Voltage: 25V; Type: Ceramic Capacitor; P/N: GRM155R71E103KA01D
D11 = 24LC024: I2C EEPROM; Manufacturer: Microchip; Capacity: 2kbit; Max Clock: 400 kHz; Voltage: 2.5-5.5V; Name: 24LC024; Package: SOIC-8; Type: I2C EEPROM
X2 = Molex_SEARAY™ 45970: 1.27mm Pitch, SEARAY Plug, 240 Circuits, 2.00mm Unmated Height, 8 Rows, with Pegs; Manufacturer: Molex; Name: 459703185; Pitch: 0.050" (1.27mm); Number of Positions: 240; P/N: 45970-3185; Mates With: SEARAY™ 45971 Series; IsBGA: TRUE; Mates With P/N: 45971-3185; Series: SEARAY™ 45970; Number of Rows: 8; Mounting Type: Surface Mount

## Nets that join several sheets
1V8_AVDD_ADC: ADC (9 pins), Power (C116.2 C117.2 C118.2 L24.2)
1V8_AVDD_ADC_CLK: ADC_CLK (8 pins), Power (C113.1 D17.1)
1V8_DRVDD_ADC: ADC (C81.2 D10.42 R35.1), ADC_CLK (12 pins), CPLD (14 pins), Power (C124.2 C125.2 C126.2 L25.2)
3V3: IF_RX (6 pins), ADC_CLK (17 pins), CPLD (27 pins), Power (C132.2 C133.2 C134.2 L26.2)
3V3_AVDD3_ADC: ADC_CLK (10 pins), Power (C121.1 D19.1)
3V3_CVDD: IF_RX (8 pins), ADC_CLK (C169.2 C182.2 D23.21 D23.35), Power (C91.1 D14.1)
3V3_CVout: ADC_CLK (10 pins), Power (C129.1 D21.1)
5V: Power (9 pins), DBoard_Conn (7 pins)
5V_AVDD: RX (C14.2 C15.2 L2.2), Power (C107.1 D16.1)
5V_CVDD: IF_RX (C63.1 D8.23 R31.2), ADC_CLK (C174.1 D23.31 R49.2 R67.2), Power (C98.1 D15.1)
5V_DEMOD: IF_RX (C36.1 C37.2 D7.18 R11.1), Power (C83.1 D12.1)
6V: Power (6 pins), DBoard_Conn (6 pins)
12V_AVDD: RX (7 pins), Power (C85.2 C86.2 C87.2 L19.2)
_3V3: RX (H1.2 H2.2), IF_RX (H3.2), ADC_CLK (H4.2), Power (8 pins)
_3V3_flt: RX (13 pins), IF_RX (C62.1 D9.8), ADC_CLK (C177.1 D24.16), Power (6 pins)
_cpld_clk: ADC_CLK (R44.1 R47.2 T4.6), CPLD (D25.M2)
_DDS_SYNC_CLK: ADC_CLK (D22.55), CPLD (R75.1)
_lo1_ref_n: IF_RX (D8.28 R20.1), ADC_CLK (C149.1)
_lo1_ref_p: IF_RX (D8.1 R20.2), ADC_CLK (C148.1)
_VCM1: IF_RX (R9.1), ADC (C72.2 D10.2)
ADC_clk_n: ADC (C76.2), ADC_CLK (C145.2 L31.2 R62.2)
ADC_clk_p: ADC (C75.2), ADC_CLK (C141.1 L29.2 R56.1)
ADC_CLKOUT_n: ADC (D10.39), DBoard_Conn (X2.C10)
ADC_CLKOUT_p: ADC (D10.40), DBoard_Conn (X2.C9)
ADC_CSB: ADC (D10.20), CPLD (R69.7)
ADC_SCLK: ADC (D10.21), CPLD (R69.6)
AGND: RX (56 pins), IF_RX (55 pins), ADC (11 pins), ADC_CLK (70 pins), Power (51 pins)
ATT1_RX_C1: RX (D4.11), CPLD (D25.K15)
ATT1_RX_C2: RX (D4.10), CPLD (D25.L12)
ATT2_MOSI_RX: RX (D6.18), CPLD (R83.3)
ATT2_RX_LE: RX (D6.16), CPLD (R83.2)
ATT2_SCLK_RX: RX (D6.17), CPLD (R83.4)
cpld_io_01: CPLD (R74.5), DBoard_Conn (X2.D20)
cpld_io_02: CPLD (R74.6), DBoard_Conn (X2.E19)
cpld_io_03: CPLD (R74.7), DBoard_Conn (X2.D21)
cpld_io_04: CPLD (R74.8), DBoard_Conn (X2.E20)
cpld_io_05: CPLD (R76.5), DBoard_Conn (X2.D23)
cpld_io_06: CPLD (R76.6), DBoard_Conn (X2.E22)
cpld_io_07: CPLD (R76.7), DBoard_Conn (X2.D24)
cpld_io_08: CPLD (R76.8), DBoard_Conn (X2.E23)
cpld_io_09: CPLD (R79.5), DBoard_Conn (X2.D26)
cpld_io_10: CPLD (R79.6), DBoard_Conn (X2.E25)
cpld_io_11: CPLD (R79.7), DBoard_Conn (X2.D29)
cpld_io_12: CPLD (R79.8), DBoard_Conn (X2.E26)
cpld_io_13: CPLD (R81.5), DBoard_Conn (X2.D27)
cpld_io_14: CPLD (R81.6), DBoard_Conn (X2.E28)
cpld_io_15: CPLD (R81.7), DBoard_Conn (X2.D30)
cpld_io_16: CPLD (R81.8), DBoard_Conn (X2.E29)
CS_LTC6948: IF_RX (D8.3), CPLD (D25.R14)
CS_LTC6951: ADC_CLK (D23.17), CPLD (D25.M15)
DA_0_1_n: ADC (D10.43), DBoard_Conn (X2.C6)
DA_0_1_p: ADC (D10.44), DBoard_Conn (X2.C5)
DA_2_3_n: ADC (D10.45), DBoard_Conn (X2.D8)
DA_2_3_p: ADC (D10.46), DBoard_Conn (X2.D7)
DA_4_5_n: ADC (D10.47), DBoard_Conn (X2.E6)
DA_4_5_p: ADC (D10.48), DBoard_Conn (X2.E5)
DA_6_7_n: ADC (D10.49), DBoard_Conn (X2.F8)
DA_6_7_p: ADC (D10.50), DBoard_Conn (X2.F7)
DA_8_9_n: ADC (D10.51), DBoard_Conn (X2.F12)
DA_8_9_p: ADC (D10.52), DBoard_Conn (X2.F11)
DA_10_11_n: ADC (D10.53), DBoard_Conn (X2.E10)
DA_10_11_p: ADC (D10.54), DBoard_Conn (X2.E9)
DA_12_13_n: ADC (D10.55), DBoard_Conn (X2.D12)
DA_12_13_p: ADC (D10.56), DBoard_Conn (X2.D11)
DA_14_15_n: ADC (D10.57), DBoard_Conn (X2.B12)
DA_14_15_p: ADC (D10.58), DBoard_Conn (X2.B11)
DB_0_1_n: ADC (D10.23), DBoard_Conn (X2.F4)
DB_0_1_p: ADC (D10.24), DBoard_Conn (X2.F3)
DB_2_3_n: ADC (D10.25), DBoard_Conn (X2.E2)
DB_2_3_p: ADC (D10.26), DBoard_Conn (X2.E1)
DB_4_5_n: ADC (D10.27), DBoard_Conn (X2.D4)
DB_4_5_p: ADC (D10.28), DBoard_Conn (X2.D3)
DB_6_7_n: ADC (D10.29), DBoard_Conn (X2.C2)
DB_6_7_p: ADC (D10.30), DBoard_Conn (X2.C1)
DB_8_9_n: ADC (D10.31), DBoard_Conn (X2.B4)
DB_8_9_p: ADC (D10.32), DBoard_Conn (X2.B3)
DB_10_11_n: ADC (D10.33), DBoard_Conn (X2.A2)
DB_10_11_p: ADC (D10.34), DBoard_Conn (X2.A1)
DB_12_13_n: ADC (D10.35), DBoard_Conn (X2.A6)
DB_12_13_p: ADC (D10.36), DBoard_Conn (X2.A5)
DB_14_15_n: ADC (D10.37), DBoard_Conn (X2.B8)
DB_14_15_p: ADC (D10.38), DBoard_Conn (X2.B7)
dds_cs: ADC_CLK (D22.70), CPLD (R82.6)
dds_d00: ADC_CLK (R42.5), DBoard_Conn (X2.A30)
dds_d01: ADC_CLK (R42.6), DBoard_Conn (X2.C28)
dds_d02: ADC_CLK (R42.7), DBoard_Conn (X2.B27)
dds_d03: ADC_CLK (R42.8), DBoard_Conn (X2.A28)
dds_d04: ADC_CLK (R45.5), DBoard_Conn (X2.C26)
dds_d05: ADC_CLK (R45.6), DBoard_Conn (X2.B25)
dds_d06: ADC_CLK (R45.7), DBoard_Conn (X2.A26)
dds_d07: ADC_CLK (R45.8), DBoard_Conn (X2.C24)
dds_d08: ADC_CLK (R48.5), DBoard_Conn (X2.B23)
dds_d09: ADC_CLK (R48.6), DBoard_Conn (X2.A24)
dds_d10: ADC_CLK (R48.7), DBoard_Conn (X2.C22)
dds_d11: ADC_CLK (R48.8), DBoard_Conn (X2.B21)
dds_d12: ADC_CLK (R50.5), DBoard_Conn (X2.A22)
dds_d13: ADC_CLK (R50.6), DBoard_Conn (X2.C20)
dds_d14: ADC_CLK (R50.7), DBoard_Conn (X2.B19)
dds_d15: ADC_CLK (R50.8), DBoard_Conn (X2.A20)
dds_f0: ADC_CLK (R55.6), DBoard_Conn (X2.B29)
dds_f1: ADC_CLK (R55.7), DBoard_Conn (X2.C30)
dds_io_reset: ADC_CLK (D22.71), CPLD (R84.6)
dds_io_update: ADC_CLK (D22.59), CPLD (R86.5)
dds_master_reset: ADC_CLK (D22.14), CPLD (R84.7)
dds_pdclk: ADC_CLK (D22.40), DBoard_Conn (X2.A18)
dds_profile0: ADC_CLK (D22.54), CPLD (R85.5)
dds_profile1: ADC_CLK (D22.53), CPLD (R85.6)
dds_profile2: ADC_CLK (D22.52), CPLD (R85.7)
dds_sclk: ADC_CLK (D22.69), CPLD (R82.5)
dds_sdio: ADC_CLK (D22.67), CPLD (R82.7)
dds_sdo: ADC_CLK (D22.68), CPLD (R82.8)
dds_sync_n: ADC_CLK (D22.8), DBoard_Conn (X2.A14)
dds_sync_p: ADC_CLK (D22.7), DBoard_Conn (X2.A13)
dds_sync_smp_err: ADC_CLK (D22.12), CPLD (R86.8)
dds_txenable: ADC_CLK (D22.41), CPLD (R86.7)
EXT_REF_ctrl: ADC_CLK (D24.14), CPLD (D25.M8)
GND: RX (T1.2 T2.2), IF_RX (C61.2 T3.2), ADC (C81.1 D10.11 D10.41), ADC_CLK (28 pins), CPLD (47 pins), Power (42 pins), DBoard_Conn (113 pins)
IFreq_Ampd_RX: RX (D6.14), IF_RX (C24.1 C27.2)
LED_Ext_Ref: ADC_CLK (T5.1), CPLD (D25.P8)
LED_RX: RX (T1.1), CPLD (D25.R8)
MISO: CPLD (R71.6), DBoard_Conn (X2.E16)
MISO_LTC5594: IF_RX (D7.21), CPLD (R72.2)
MISO_LTC6948: IF_RX (D8.6), CPLD (R73.2)
MISO_LTC6951: ADC_CLK (D23.20), CPLD (R70.2)
MOSI: CPLD (R71.7), DBoard_Conn (X2.E17)
MOSI_LTC5594: IF_RX (D7.22), CPLD (R72.3)
MOSI_LTC6948: IF_RX (D8.5), CPLD (R73.3)
MOSI_LTC6951: ADC_CLK (D23.19), CPLD (R70.3)
OF2_1_n: ADC (D10.59), DBoard_Conn (X2.A10)
OF2_1_p: ADC (D10.60), DBoard_Conn (X2.A9)
ram_swp_ovr: ADC_CLK (D22.24), CPLD (R86.6)
ref_freq_rx_n: ADC_CLK (C151.1), DBoard_Conn (X2.C14)
ref_freq_rx_p: ADC_CLK (C150.1), DBoard_Conn (X2.C13)
RX_IFIA_N: IF_RX (C55.2 L18.2 R27.2), ADC (D10.5)
RX_IFIA_P: IF_RX (C49.1 L15.2 R21.1), ADC (D10.4)
RX_IFIB_N: IF_RX (C43.2 L11.2 R17.2), ADC (D10.13)
RX_IFIB_P: IF_RX (C39.1 L9.2 R12.1), ADC (D10.12)
SCLK: CPLD (R71.8), DBoard_Conn (X2.E15)
SCLK_AD7922: RX (D1.3), CPLD (R78.4)
SCLK_AD7922_2: IF_RX (D9.3), CPLD (R80.4)
SCLK_LTC5594: IF_RX (D7.23), CPLD (R72.4)
SCLK_LTC6948: IF_RX (D8.4), CPLD (R73.4)
SCLK_LTC6951: ADC_CLK (D23.18), CPLD (R70.4)
SDI_AD7922: RX (D1.4), CPLD (R78.2)
SDI_AD7922_2: IF_RX (D9.4), CPLD (R80.2)
SDO_AD7922: RX (D1.1), CPLD (R78.3)
SDO_AD7922_2: IF_RX (D9.1), CPLD (R80.3)
SEN: CPLD (R71.5), DBoard_Conn (X2.E14)
SEN_AD7922: RX (D1.2), CPLD (R78.1)
SEN_AD7922_2: IF_RX (D9.2), CPLD (R80.1)
SEN_LTC5594: IF_RX (D7.17), CPLD (R72.1)
STAT_LTC6948: IF_RX (C61.1 D8.2 T3.1), CPLD (R73.1)
STAT_LTC6951: ADC_CLK (D23.38), CPLD (D25.N15)
SYNC_LTC6951: ADC_CLK (D23.39 R68.2), CPLD (R70.1)
TPS_EN: CPLD (D25.N8), Power (D13.11)